# EAGLE design stencil (EAGLE 9.6.2)

## Sheet 1 of 2
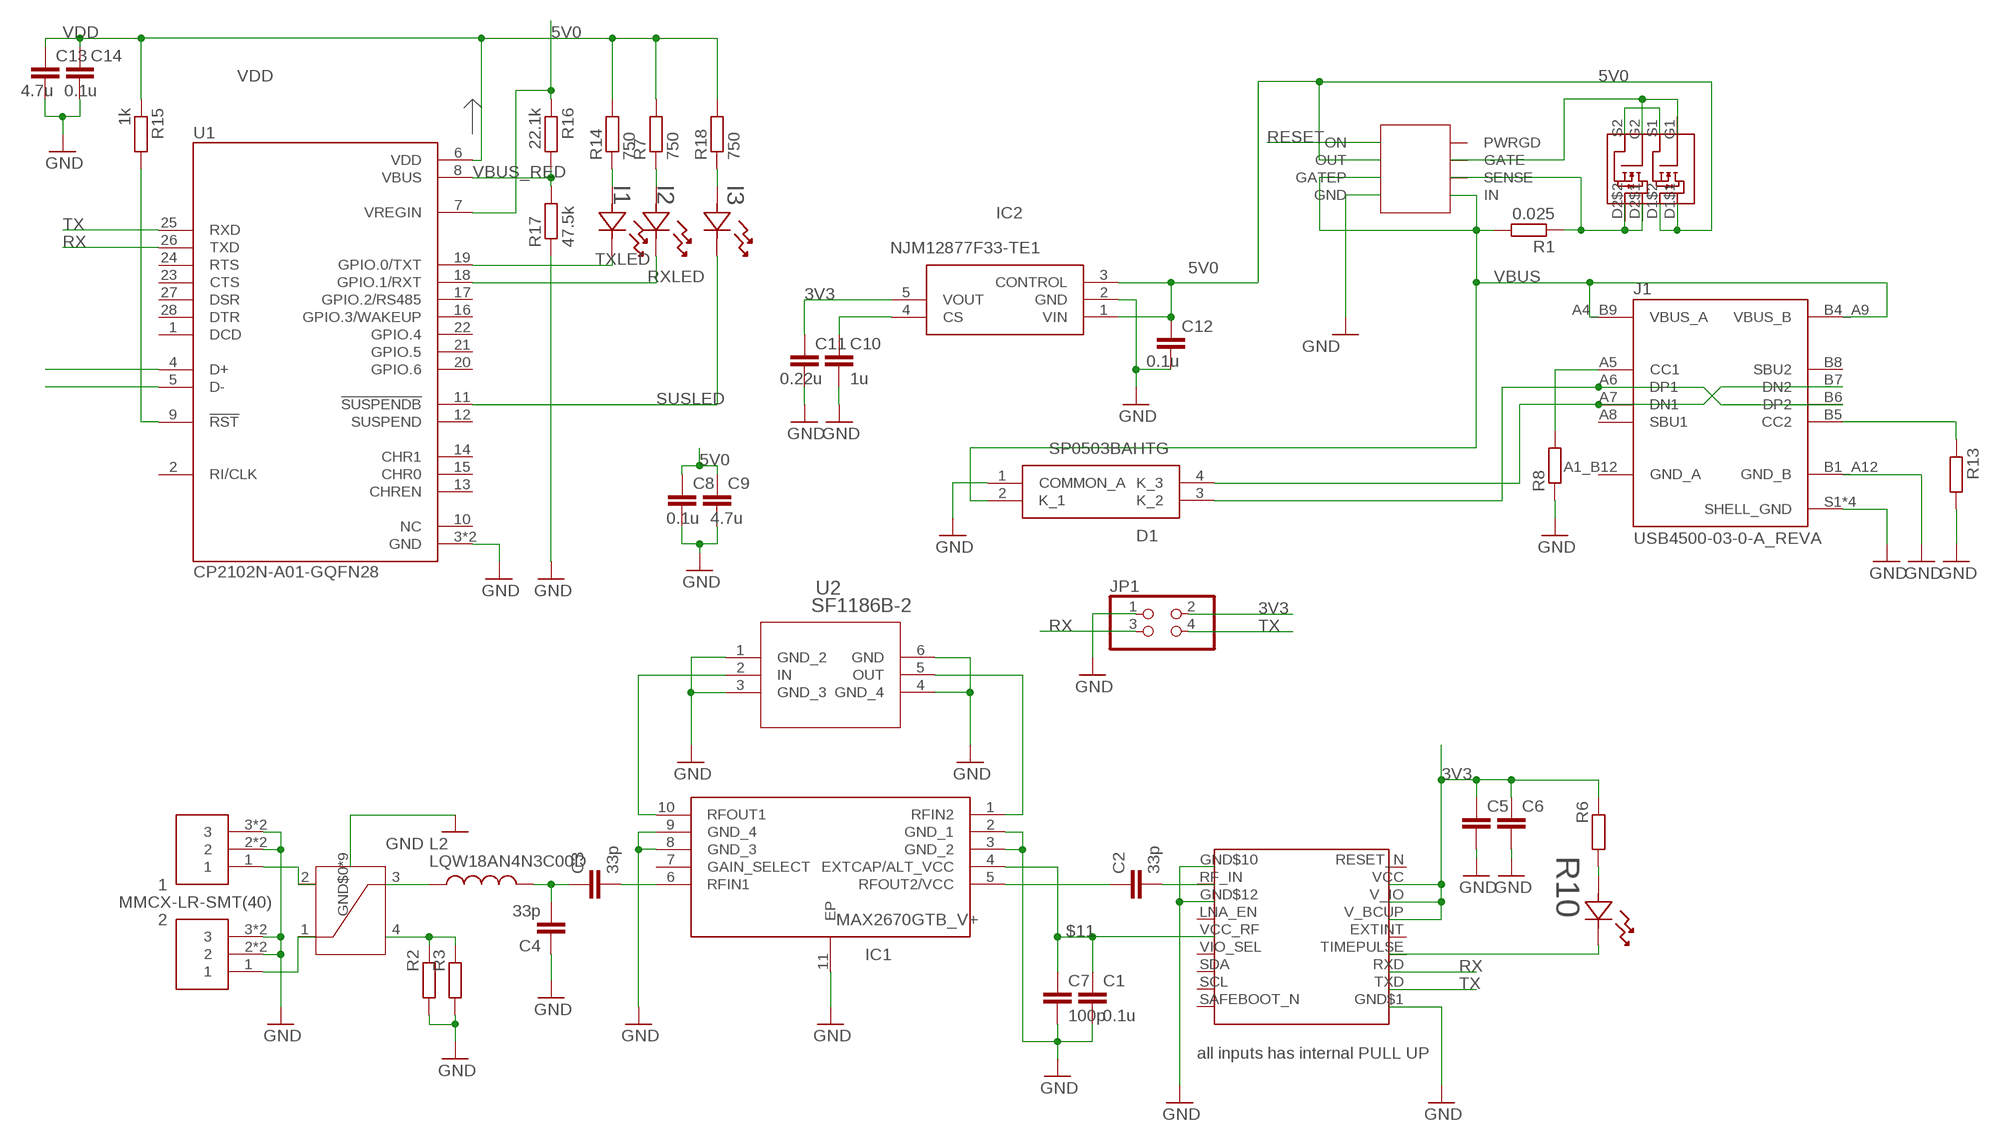
[diagram p0: schematic, sheet 1]

### Parts
1  MMCX-LR-SMT(40)  [MMCX-LR-SMT(40)]
2  MMCX-LR-SMT(40)  [MMCX-LR-SMT(40)]
C1  0.1u  C-EUC1608  [C1608]
C2  33p  C-EUC1608  [C1608]
C3  33p  C-EUC1608  [C1608]
C4  33p  C-EUC1608  [C1608]
C5  C-EUC1608  [C1608]
C6  C-EUC1608  [C1608]
C7  100p  C-EUC1608  [C1608]
C8  0.1u  C-EUC1608  [C1608]
C9  4.7u  C-EUC1608  [C1608]
C10  1u  C-EUC1608  [C1608]
C11  0.22u  C-EUC1608  [C1608]
C12  0.1u  C-EUC1608  [C1608]
C13  4.7u  C-EUC1608  [C1608]
C14  0.1u  C-EUC1608  [C1608]
D1  SP0503BAHTG  [SP0503BAHTG]
I1  SML-E12P8WT86  [LED_SMLD12_ROM]
I2  SML-E12P8WT86  [LED_SMLD12_ROM]
I3  SML-E12P8WT86  [LED_SMLD12_ROM]
IC1  MAX2670GTB_V+  [SON50P300X300X80-11N]
IC2  NJM12877F33-TE1  [SOT95P280X120-5N]
J1  USB4500-03-0-A_REVA  [GCT_USB4500-03-0-A_REVA]
JP1  PINHD-2X2  [2X02]
L2  LQW18AN4N3C00D  [INDC1608X100N]
R1  0.025  R-EU_R0603  [R0603]
R2  R-EU_R0603  [R0603]
R3  R-EU_R0603  [R0603]
R6  R-EU_R0603  [R0603]
R7  750  R-EU_R0603  [R0603]
R8  R-EU_R0603  [R0603]
R10  SML-E12P8WT86  [LED_SMLD12_ROM]
R13  R-EU_R0603  [R0603]
R14  750  R-EU_R0603  [R0603]
R15  1k  R-EU_R0603  [R0603]
R16  22.1k  R-EU_R0603  [R0603]
R17  47.5k  R-EU_R0603  [R0603]
R18  750  R-EU_R0603  [R0603]
U1  CP2102N-A01-GQFN28  [QFN50P500X500X80-29N]
U2  SF1186B-2  [SM3030_MUR]
U$1  MAX_M10S  [MAX-M10S]
U$3  HC125.A  [HC125.A]
U$7  DMG6898LSD  [SOIC127P600X150-8N]
U$8  LTC4361  [SOP65P280X100-8N]

### Nets
3V3 [POWER]: C5.1 C6.1 C11.1 IC2.5(VOUT) JP1.2 R6.2 U$1.V_BCUP(V_BCKP) U$1.V_IO U$1.VCC ; also sheet 2
5V0 [POWER]: C8.1 C9.1 C12.1 IC2.1(VIN) IC2.3(CONTROL) R16.1 U1.7(VREGIN) U$7.D1$1 U$7.D1$2 U$8.OUT ; also sheet 2
$11 [POWER]: C1.1 C7.1 IC1.4(EXTCAP/ALT_VCC) U$1.VCC_RF
D+: D1.3(K_2) J1.A6(DP1) J1.B6(DP2) U1.4(D+)
D-: D1.4(K_3) J1.A7(DN1) J1.B7(DN2) U1.5(D-)
GND [50Ohm]: 1.2 1.3 1.4 1.5 2.2 2.3 2.4 2.5 C1.2 C4.1 C5.2 C6.2 C7.2 C8.2 C9.2 C10.2 C11.2 C12.2 C13.2 C14.2 D1.1(COMMON_A) IC1.2(GND_1) IC1.3(GND_2) IC1.8(GND_3) IC1.9(GND_4) IC1.11(EP) IC2.2(GND) J1.B1_A12(GND_B) J1.S1(SHELL_GND) J1.S2(SHELL_GND) J1.S3(SHELL_GND) J1.S4(SHELL_GND) JP1.1 R2.1 R3.1 R8.1 R13.2 R17.1 U1.3(GND) U1.29(GND) U2.1(GND_2) U2.3(GND_3) U2.4(GND_4) U2.6(GND) U$1.GND$1 U$1.GND$10 U$1.GND$12 U$3.GND$0(GND) U$3.GND$1(GND) U$3.GND$2(GND) U$3.GND$3(GND) U$3.GND$4(GND) U$3.GND$5(GND) U$3.GND$6(GND) U$3.GND$7(GND) U$3.GND$8(GND) U$8.GND ; also sheet 2
N$1 [1.1mm]: 1.1 U$3.2
N$2 [1.1mm]: 2.1 U$3.1
N$4: C10.1 IC2.4(CS)
N$5: I2.2 R7.1
N$6 [gnd]: R2.2 R3.2 U$3.4
N$7 [gnd]: L2.1 U$3.3
N$8 [gnd]: IC1.10(RFOUT1) U2.2(IN)
N$9 [gnd]: IC1.1(RFIN2) U2.5(OUT)
N$10 [gnd]: C3.2 IC1.6(RFIN1)
N$11 [gnd]: C2.1 IC1.5(RFOUT2/VCC)
N$12 [gnd]: C2.2 U$1.RF_IN
N$13: I1.2 R14.1
N$14: R10.1 U$1.TIMEPULSE
N$15: R6.1 R10.2
N$16: I3.2 R18.1
N$17 [gnd]: C3.1 C4.2 L2.2
N$19: U$7.S1 U$7.S2
N$20: R1.1 U$7.D2$1 U$7.D2$2 U$8.SENSE
N$21: J1.B5(CC2) R13.1
N$22: U$7.G1 U$7.G2 U$8.GATE
N$23: J1.A5(CC1) R8.2
N$27: R15.2 U1.9(!RST)
RESET [50Ohm]: U$8.ON
RX: JP1.3 U1.26(TXD) U$1.RXD ; also sheet 2
RXLED: I2.1 U1.18(GPIO.1/RXT)
SUSLED: I3.1 U1.11(!SUSPENDB)
TX: JP1.4 U1.25(RXD) U$1.TXD ; also sheet 2
TXLED: I1.1 U1.19(GPIO.0/TXT)
VBUS: D1.2(K_1) J1.A4_B9(VBUS_A) J1.B4_A9(VBUS_B) R1.2 U$8.GATEP U$8.IN
VBUS_RED: R16.2 R17.2 U1.8(VBUS)
VDD: C13.1 C14.1 R7.2 R14.2 R15.1 R18.2 U1.6(VDD)
Unconnected: IC1.7(GAIN_SELECT) J1.A8(SBU1) J1.B8(SBU2) U1.1(DCD) U1.2(RI/CLK) U1.10(NC) U1.12(SUSPEND) U1.13(CHREN) U1.14(CHR1) U1.15(CHR0) U1.16(GPIO.3/WAKEUP) U1.17(GPIO.2/RS485) U1.20(GPIO.6) U1.21(GPIO.5) U1.22(GPIO.4) U1.23(CTS) U1.24(RTS) U1.27(DSR) U1.28(DTR) U$1.EXTINT U$1.LNA_EN U$1.RESET_N U$1.SAFEBOOT_N U$1.SCL U$1.SDA U$1.VIO_SEL U$8.PWRGD

### Notes on the sheet
- all inputs has internal PULL UP

## Sheet 2 of 2
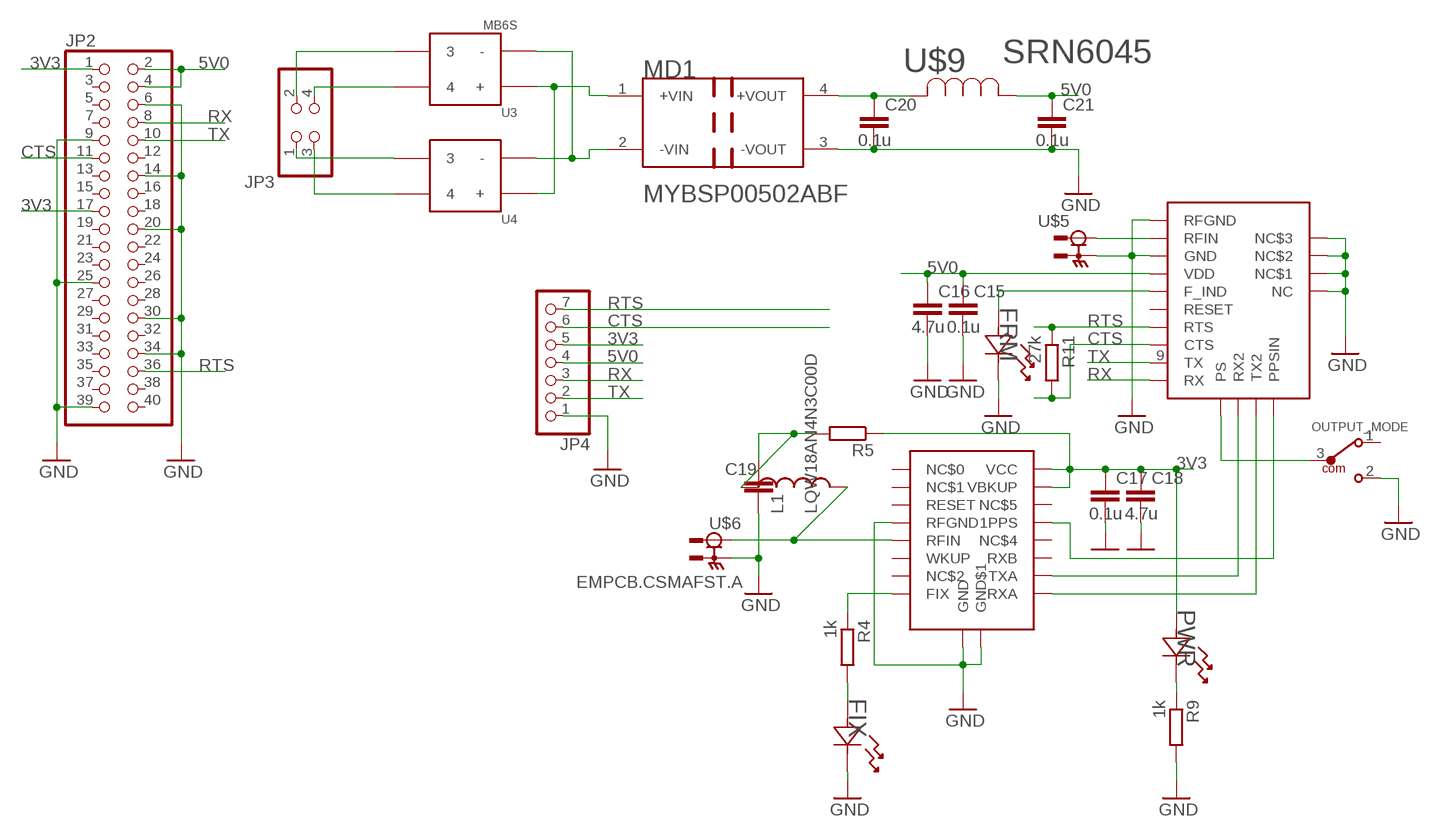
[diagram p1: schematic, sheet 2]

### Parts
C15  0.1u  C-EUC1608  [C1608]
C16  4.7u  C-EUC1608  [C1608]
C17  0.1u  C-EUC1608  [C1608]
C18  4.7u  C-EUC1608  [C1608]
C19  C-EUC1608  [C1608]
C20  0.1u  C-EUC1608  [C1608]
C21  0.1u  C-EUC1608  [C1608]
FIX  SML-E12P8WT86  [LED_SMLD12_ROM]
FRM  SML-E12P8WT86  [LED_SMLD12_ROM]
JP2  PINHD-2X20  [2X20]
JP3  PINHD-2X2  [2X02]
JP4  PINHD-1X7/90  [1X07/90]
L1  LQW18AN4N3C00D  [INDC1608X100N]
MD1  MURATA_MYBSP00502ABFMURATA_MYBSP00502ABF_0_0  [MURATA_MYBSP00502ABF_0]
OUTPUT_MODE  450405020524  [450405020524]
PWR  SML-E12P8WT86  [LED_SMLD12_ROM]
R4  1k  R-EU_R0603  [R0603]
R5  R-EU_R0603  [R0603]
R9  1k  R-EU_R0603  [R0603]
R11  27k  R-EU_R0603_NOSILK  [R0603_NOSILK]
U3  MB6S  [SOIC245P670X270-4N]
U4  MB6S  [SOIC245P670X270-4N]
U$2  GNS5894T  [GNS5XXX]
U$4  GNS3303  [GNS3303]
U$5  EMPCB.CSMAFST.A  [EMPCB.CSMAFST.A]
U$6  EMPCB.CSMAFST.A  [EMPCB.CSMAFST.A]
U$9  SRN6045  [IND_BOURNS_SRN6045]

### Nets
3V3 [POWER]: C17.1 C18.1 JP2.1 JP2.17 JP4.5 PWR.2 R5.1 U$4.15(VBKUP) U$4.16(VCC) ; also sheet 1
5V0 [POWER]: C15.1 C16.1 C21.1 JP2.2 JP2.4 JP4.4 U$2.4(VDD) U$9.1 ; also sheet 1
CTS: JP2.11 JP4.6 R11.2 U$2.8(CTS)
GND [50Ohm]: C15.2 C16.2 C17.2 C18.2 C19.2 C20.2 C21.2 FIX.1 FRM.1 JP2.6 JP2.9 JP2.14 JP2.20 JP2.25 JP2.30 JP2.34 JP2.39 JP4.1 MD1.3(-VOUT) OUTPUT_MODE.2 R9.2 U$2.1(RFGND) U$2.3(GND) U$2.15(NC) U$2.16(NC$1) U$2.17(NC$2) U$2.18(NC$3) U$4.4(RFGND) U$4.E1(GND) U$4.E2(GND$1) U$5.GND$0 U$5.GND$1 U$5.GND$2 U$5.GND$3 U$6.GND$0 U$6.GND$1 U$6.GND$2 U$6.GND$3 ; also sheet 1
N$3: FRM.2 U$2.5(F_IND)
N$18: U$2.12(RX2) U$4.10(TXA)
N$24: U$2.13(TX2) U$4.9(RXA)
N$25: U$2.14(PPSIN) U$4.13(1PPS)
N$26: R4.1 U$4.8(FIX)
N$28: FIX.2 R4.2
N$29 [50Ohm]: C19.1 L1.1 R5.2
N$30: OUTPUT_MODE.3 U$2.11(PS)
N$31: PWR.1 R9.1
N$32: JP3.4 U3.4
N$33: JP3.2 U3.3
N$34: JP3.3 U4.4
N$35: JP3.1 U4.3
N$36: MD1.2(-VIN) U3.2(-) U4.2(-)
N$37: MD1.1(+VIN) U3.1(+) U4.1(+)
N$38: C20.1 MD1.4(+VOUT) U$9.2
RF1 [50Ohm]: L1.2 U$4.5(RFIN) U$6.RF
RF2 [50Ohm]: U$2.2(RFIN) U$5.RF
RTS: JP2.36 JP4.7 R11.1 U$2.7(RTS)
RX: JP2.8 JP4.3 U$2.10(RX) ; also sheet 1
TX: JP2.10 JP4.2 U$2.9(TX) ; also sheet 1
Unconnected: JP2.3 JP2.5 JP2.7 JP2.12 JP2.13 JP2.15 JP2.16 JP2.18 JP2.19 JP2.21 JP2.22 JP2.23 JP2.24 JP2.26 JP2.27 JP2.28 JP2.29 JP2.31 JP2.32 JP2.33 JP2.35 JP2.37 JP2.38 JP2.40 OUTPUT_MODE.1 U$2.6(RESET) U$4.1(NC$0) U$4.2(NC$1) U$4.3(RESET) U$4.6(WKUP) U$4.7(NC$2) U$4.11(RXB) U$4.12(NC$4) U$4.14(NC$5)

## Power pins joined to a net without a drawn wire
GND: J1.A1_B12(GND_A)

## Library data of the parts
1 2 = MMCX-LR-SMT(40):MMCX-LR-SMT(40)
C1-C21 = rcl:C-EU: CAPACITOR, European symbol; SPICEPREFIX: C
D1 = SamacSys_Parts:SP0503BAHTG: ESD Suppressors / TVS Diodes TVS AVAL DIODE SMT Source: Datasheet <https://nl.mouser.com/datasheet/2/240/Littelfuse_TVS_Diode_Array_SP05_Datasheet.pdf-777043.pdf>; ARROW_PART_NUMBER: SP0503BAHTG; ARROW_PRICE-STOCK: https://www.arrow.com/en/products/sp0503bahtg/littelfuse?region=europe; DESCRIPTION: ESD Suppressors / TVS Diodes TVS AVAL DIODE SMT; HEIGHT: 1.22mm; MANUFACTURER_NAME: LITTELFUSE; MANUFACTURER_PART_NUMBER: SP0503BAHTG; MOUSER_PART_NUMBER: 576-SP0503BAHTG; MOUSER_PRICE-STOCK: https://www.mouser.co.uk/ProductDetail/Littelfuse/SP0503BAHTG?qs=uD%2FdkN7XIa0NTYXwHdELYA%3D%3D
FIX FRM I1-I3 PWR R10 = LED_1608_2:SML-E12P8WT86; COPYRIGHT: Copyright (C) 2023 Ultra Librarian. All rights reserved.; DIGI-KEY_PART_NUMBER_1: 511-1585-1-ND; DIGI-KEY_PART_NUMBER_2: 511-1585-2-ND; DIGI-KEY_PART_NUMBER_3: 511-1585-6-ND; MANUFACTURER_PART_NUMBER: SML-E12P8WT86; MFR_NAME: ROHM Semiconductor
IC1 = MAX2670GTB_V+:MAX2670GTB_V+: RF Amplifier GPS/GNSS Front End Amplifier Source: Datasheet <https://componentsearchengine.com/Datasheets/1/MAX2670GTB_V .pdf>; DESCRIPTION: RF Amplifier GPS/GNSS Front End Amplifier; HEIGHT: 0.8mm; MANUFACTURER_NAME: Analog Devices; MANUFACTURER_PART_NUMBER: MAX2670GTB/V+; MOUSER_PART_NUMBER: 700-MAX2670GTB/V+; MOUSER_PRICE-STOCK: https://www.mouser.com/Search/Refine.aspx?Keyword=700-MAX2670GTB%2FV%2B
IC2 = SamacSys_Parts:NJM12877F33-TE1: LDO Voltage Regulators LDO ADJ High Ripple 3.3V Vo 1% 200mA Source: Datasheet <https://datasheet.datasheetarchive.com/originals/distributors/Datasheets_SAMA/e828f6bebe4b9138c37698b69374413c.pdf>; DESCRIPTION: LDO Voltage Regulators LDO ADJ High Ripple 3.3V Vo 1% 200mA; HEIGHT: 1.2mm; MANUFACTURER_NAME: New Japan Radio; MANUFACTURER_PART_NUMBER: NJM12877F33-TE1; MOUSER_PART_NUMBER: 513-NJM12877F33-TE1; MOUSER_PRICE-STOCK: https://www.mouser.com/Search/Refine.aspx?Keyword=513-NJM12877F33-TE1
J1 = USB4500-03-0-A_REVA:USB4500-03-0-A_REVA; DESCRIPTION: USB-C (USB TYPE-C) USB 2.0 Receptacle Connector 24 (16+8 Dummy) Position Board Edge, Cutout; Surface Mount; Through Hole, Right Angle; DIGI-KEY_PART_NUMBER: 2073-USB4500-03-0-ATR-ND; MF: Global Connector Technology; MP: USB4500-03-0-A; PACKAGE: None; PURCHASE-URL: https://pricing.snapeda.com/search/part/USB4500-03-0-A/?ref=eda
JP1 JP3 = pinhead:PINHD-2X2: PIN HEADER
JP2 = pinhead:PINHD-2X20: PIN HEADER
JP4 = pinhead:PINHD-1X7: PIN HEADER
L1 L2 = LQW18AN4N3C00D:LQW18AN4N3C00D: 2.3 NH +/-.1NH; DESCRIPTION: Inductor with Inductance: 4.3nH Tol. +/-0.2nH, Package: 0603 (1608); DIGIKEY_PART_NUMBER: 490-6896-2-ND; MF: Murata; MP: LQW18AN4N3C00D; PACKAGE: 1608 Murata; PURCHASE-URL: https://pricing.snapeda.com/search?q=LQW18AN4N3C00D&ref=eda
MD1 = MURATA_MYBSP00502ABF:MURATA_MYBSP00502ABF: Isolated PoE Module DC DC Converter Output 5V - - - 2A 37V - 57V Input Check availability <https://pricing.snapeda.com/parts/MYBSP00502ABF/Murata%20Power%20Solutions%20Inc./view-part?ref=eda>; AVAILABILITY: In Stock; DESCRIPTION: Isolated PoE Module DC DC Converter 1 Output 5V - - - 2A 37V - 57V Input; MF: Murata Power Solutions Inc.; MP: MYBSP00502ABF; PACKAGE: None; PRICE: None; PURCHASE-URL: https://pricing.snapeda.com/search?q=MYBSP00502ABF&ref=eda
OUTPUT_MODE = WS-SLSU (rev20b):450405020524: WS-SLSU SMT Mini Slide Switch Same Side Connection 8.7x3.0 mm PROPERTIES Actuator Material PA46 Actuator Flammability Rating UL94 HB Actuator Color Black Frame Material LCP Frame Flammability Rating UL94 V-0 Frame Color Black Contact Material Copper Alloy Contact Plating Silver Terminal Material Copper Alloy Terminal Plating Silver VR 5 V (DC) Contact Resistance Initial 70 mΩ Contact Resistance After Life Test 500 mΩ RISO 100 MΩ Withstanding Voltage 250 V (AC) ELECTRICAL PROPERTIES IR 300 mA MECHANICAL PROPERTIES Operation Force 225 g PACKAGING PROPERTIES Packaging Tape and Reel <https://katalog.we-online.com/media/images/v2/o158949v209%20WS-SLSU-450405020524.jpg> Details see: https://www.we-online.com/catalog/en/WS_SLSU_SMT_MINI_SLIDE_SWITCH_SAME_SIDE_8_7_x_3_0/ Updated by Ella Wu 2020-03-24 2020(C) Wurth Elektronik; DATASHEET-URL: https://www.we-online.com/catalog/datasheet/450405020524.pdf; IR: 300mA; PACKAGING: Tape and Reel; PART-NUMBER: 450405020524; VR: 5V(DC)
R1-R9 R13-R18 = rcl:R-EU_: RESISTOR, European symbol; SPICEPREFIX: R
R11 = rcl:R-EU_: RESISTOR, European symbol
U1 = CP2102N-A01-GQFN28:CP2102N-A01-GQFN28: USB Bridge, USB to UART USB 2.0 UART Interface 28-QFN (5x5) Check availability <https://pricing.snapeda.com/parts/CP2102N-A01-GQFN28/Silicon%20Labs/view-part?ref=eda>; AVAILABILITY: In Stock; DESCRIPTION: USB Bridge, USB to UART USB 2.0 UART Interface 28-QFN (5x5); MF: Silicon Labs; MP: CP2102N-A01-GQFN28; PACKAGE: QFN-28 Silicon Labs; PRICE: None; PURCHASE-URL: https://pricing.snapeda.com/search/part/CP2102N-A01-GQFN28/?ref=eda
U2 = SF1186B-2:SF1186B-2; COPYRIGHT: Copyright (C) 2023 Ultra Librarian. All rights reserved.; MANUFACTURER_PART_NUMBER: SF1186B-2; MFR_NAME: Murata
U3 U4 = MB6S:MB6S: MB6S Series 600 V 0.5 A 5 uA Surface Mount Bridge Rectifier - SOIC-4 Check availability <https://pricing.snapeda.com/parts/MB6S/onsemi/view-part?ref=eda>; AVAILABILITY: In Stock; DESCRIPTION: Bridge Rectifier Single Phase Standard 600 V Surface Mount 4-SOIC; MF: onsemi; MP: MB6S; PACKAGE: None; PRICE: None; PURCHASE-URL: https://pricing.snapeda.com/search?q=MB6S&ref=eda
U$1 = MAX-M10S:MAX_M10S
U$2 = GNS5894T:GNS5894T
U$3 = HC125.A:HC125.A
U$4 = GNS3303:GNS3303
U$5 U$6 = EMPCB.CSMAFSTJ.A:EMPCB.CSMAFST.A
U$7 = DMG6898LSD:DMG6898LSD
U$8 = ltc4361:LTC4361
U$9 = SRN6045:SRN6045

## Net classes
0 default: clearance 0.121 mm
1 gnd: width 0.254 mm, clearance 0.254 mm
2 50Ohm: clearance 0.4 mm to class 1
3 POWER: width 0.127 mm, clearance 0.025 mm
4 1.1mm: clearance 0.247 mm to class 1

## Board
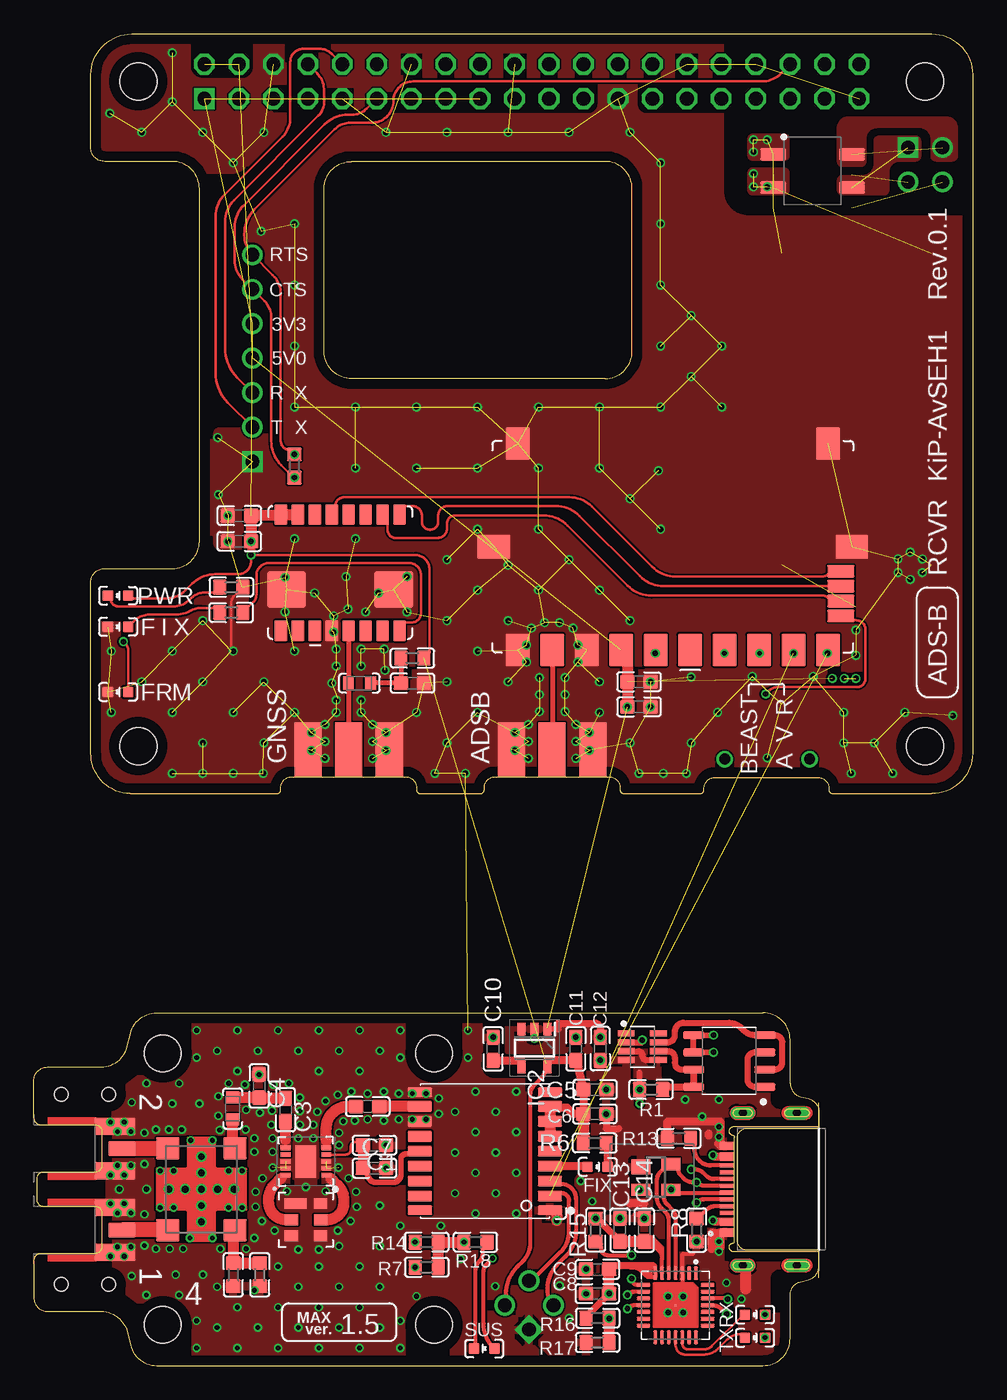
[diagram p2: board, top side]
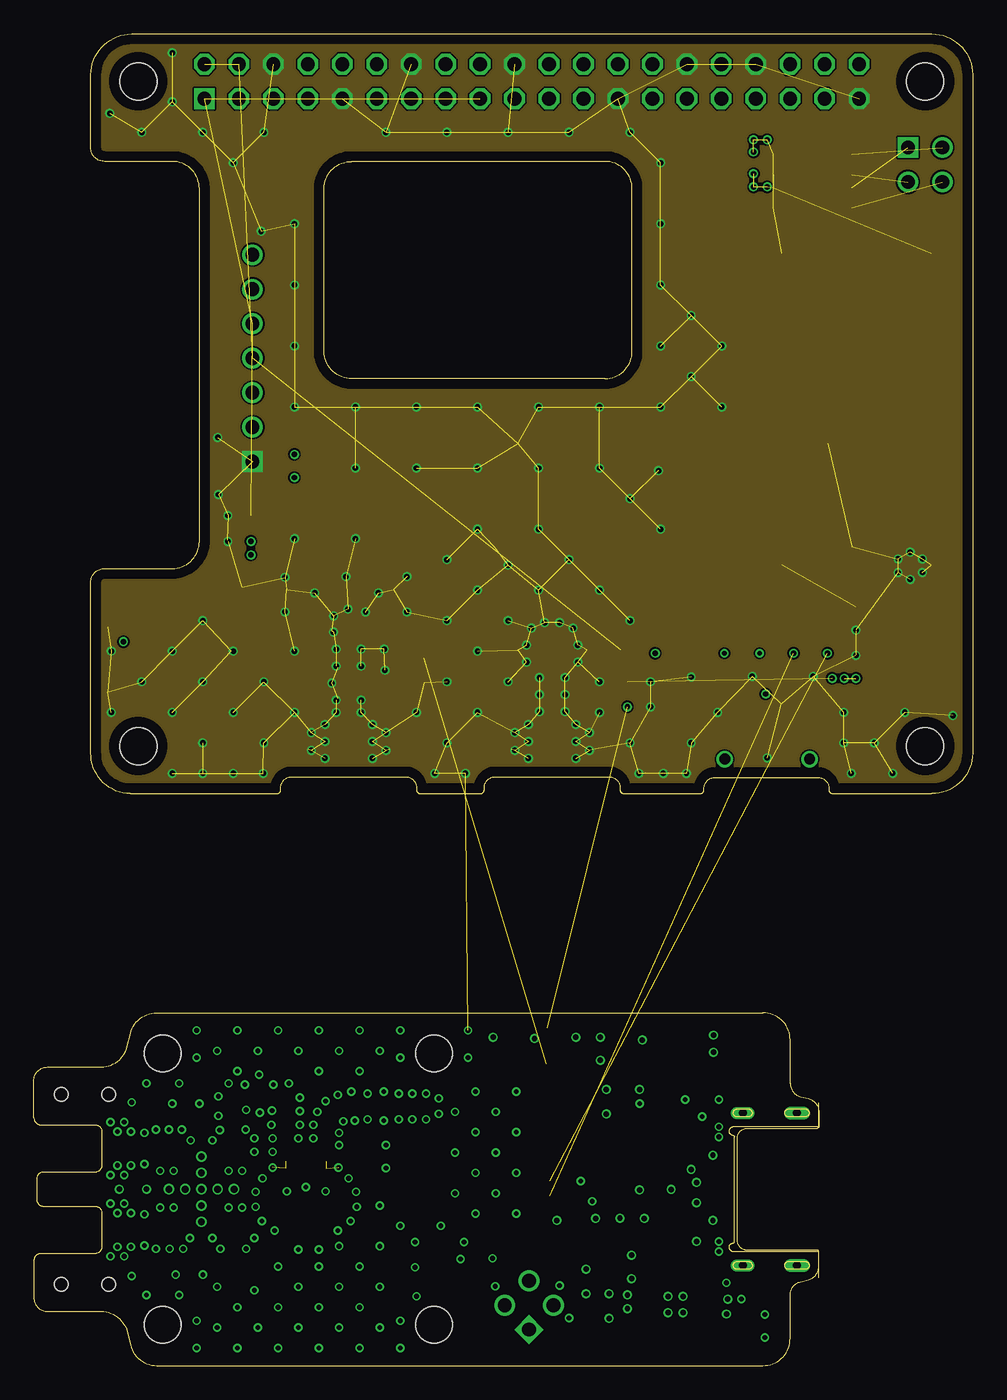
[diagram p3: board, inner layer Route2]
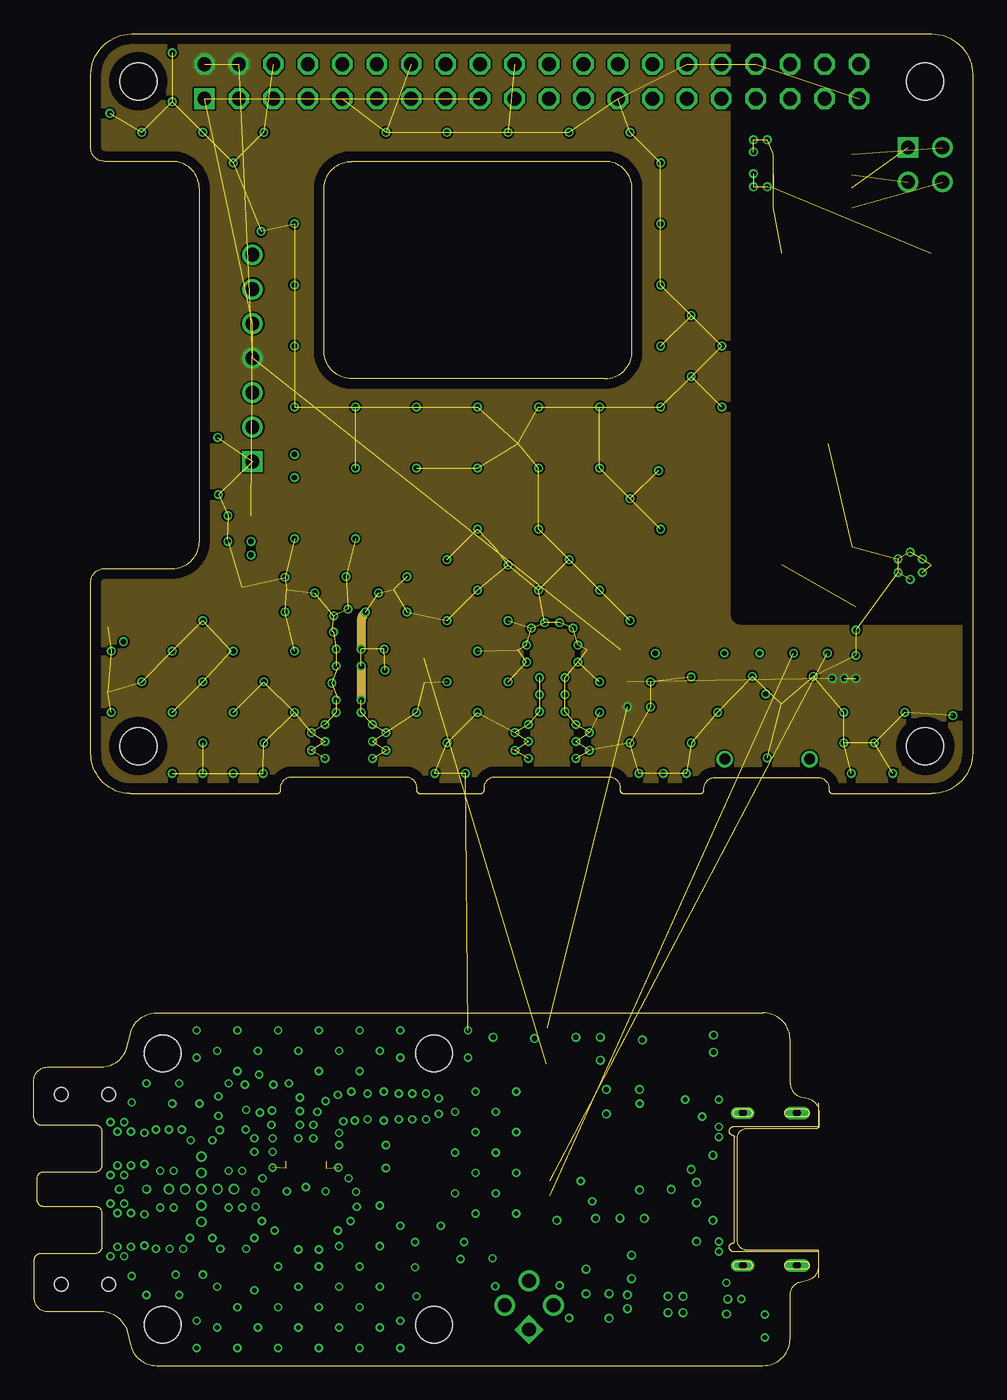
[diagram p4: board, inner layer Route15]
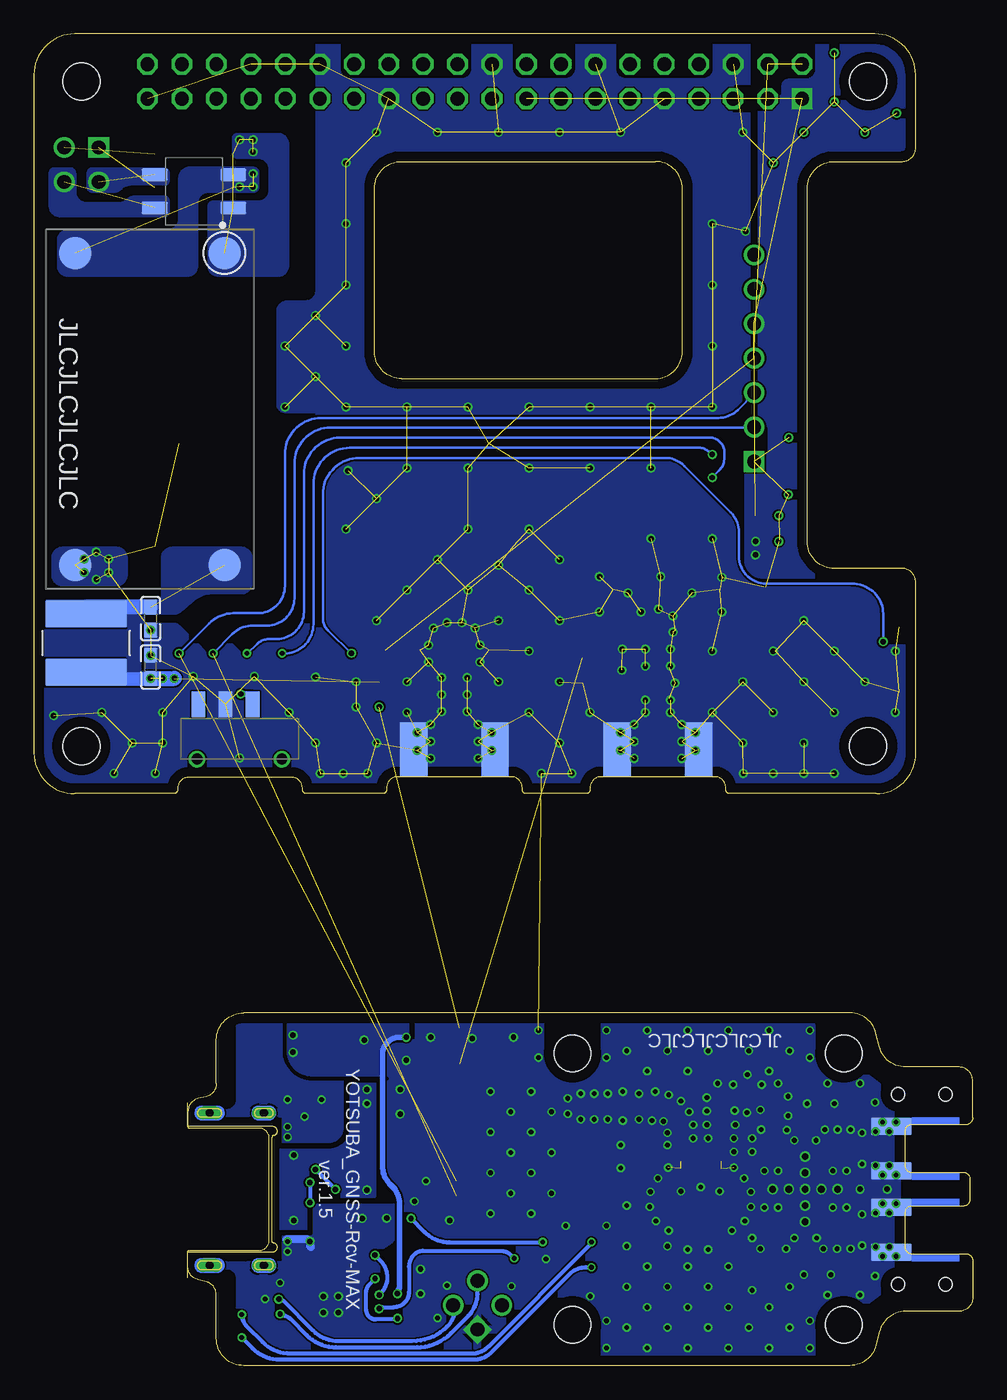
[diagram p5: board, bottom side, seen from below]

Size 69.2 x 98.15 mm. Coordinates in mm from the lower left corner, seen from the top.
Outline: 1,4 4.94,4 arc-76 6.88,2.48 7.12,1.51 arc76 9.06,0 53.75,0 arc90 55.75,2 55.75,5.21 arc-77 56.52,6.18 57.08,6.32 arc77 57.85,7.29 57.85,8.4 arc90 57.75,8.5 52.6,8.5 arc-90 51.85,9.25 51.85,16.75 arc-90 52.6,17.5 57.75,17.5 arc90 57.85,17.6 57.85,18.71 arc77 57.08,19.68 56.52,19.82 arc-77 55.75,20.79 55.75,24 arc90 53.75,26 9.06,26 arc76 7.12,24.48 6.88,23.52 arc-76 4.94,22 1,22 arc90 0,21 0,18.25 arc90 0.5,17.75 4.5,17.75 arc-90 5,17.25 5,14.75 arc-90 4.5,14.25 0.7,14.25 arc90 0.2,13.75 0.2,12.25 arc90 0.7,11.75 4.5,11.75 arc-90 5,11.25 5,8.75 arc-90 4.5,8.25 0.5,8.25 arc90 0,7.75 0,5 arc90 1,4
Outline: 28.2,42.6 28.2,42.45 arc90 28.5,42.15 32.9,42.15 arc90 33.2,42.45 33.2,42.6 arc-90 34,43.4 42.4,43.4 arc-90 43.2,42.6 43.2,42.45 arc90 43.5,42.15 49.1,42.15 arc90 49.4,42.45 49.4,42.55 arc-90 50.2,43.35 57.8,43.35 arc-90 58.6,42.55 58.6,42.45 arc90 58.9,42.15 66.2,42.15 arc90 69.2,45.15 69.2,95.15 arc90 66.2,98.15 7.2,98.15 arc90 4.2,95.15 4.2,89.75 arc90 5.2,88.75 10.2,88.75 arc-90 12.2,86.75 12.2,60.75 arc-90 10.2,58.75 5.2,58.75 arc90 4.2,57.75 4.2,45.15 arc90 7.1,42.15 17.9,42.15 arc90 18.2,42.45 18.2,42.6 arc-90 19,43.4 27.4,43.4 arc-90 28.2,42.6
Outline: 42.1,72.75 23.4,72.75 arc-90 21.4,74.75 21.4,86.75 arc-90 23.4,88.75 42.1,88.75 arc-90 44.1,86.75 44.1,74.75 arc-90 42.1,72.75
Copper layers (1*16): Top 0.035mm / dielectric 0.2104mm / Bottom 0.035mm
Design rules "JLCPCB_2L *": minimum track width 5mil, minimum drill 0.15mm, track to track 5mil, track to pad 5mil, pad to pad 5mil, via to via 5mil, smd to smd 5mil, copper to edge 30mil, drill to drill 0.5mm, minimum pad ring 0.13mm, minimum via ring 0.13mm, stop-mask expansion 0.038mm, vias tented up to drill 0.4mm, thermal gap 10mil
Holes 1 mm at 2,6 5.5,6 2,20 5.5,20
Holes 2.7 mm at 9.5,3 9.5,23 29.5,23 29.5,3
Holes 2.75 mm at 7.7,45.65 7.7,94.65 65.7,94.65 65.7,45.65
tRestrict: area 47.3,95.1 to 49,96.7; area 34.6,95.2 to 36.3,96.7; area 27.1,95.2 to 28.6,96.7; area 21.9,92.6 to 23.6,94.2; 103 lines
bRestrict: 69 lines

### Footprints (pad centres in the part's own frame; a part is rotated, then mirrored left to right if it is on the bottom)
MMCX-LR-SMT(40) = smd 1.1 x 2: 1 0,-2 | smd 1.3 x 3: 2 1.65,-1.5; 3 -1.65,-1.5 | smd 1.3 x 3 bottom: 4 -1.65,-1.5; 5 1.65,-1.5
C1608 = smd 1.1 x 1: 1 -0.85,0; 2 0.85,0
SP0503BAHTG = smd 1.1 x 1.4: 1 -0.75,-1.1 | smd 0.9 x 1.4: 2 0.95,-1.1; 3 0.95,1.1; 4 -0.95,1.1
LED_SMLD12_ROM = smd 0.8 x 0.8: 1 -0.75,0; 2 0.75,0
SON50P300X300X80-11N = smd 0.75 x 0.3: 1 -1.5,1; 2 -1.5,0.5; 3 -1.5,0; 4 -1.5,-0.5; 5 -1.5,-1; 6 1.5,-1; 7 1.5,-0.5; 8 1.5,0; 9 1.5,0.5; 10 1.5,1 | smd 1.6 x 2.4: 11 0,0
SOT95P280X120-5N = smd 0.9 x 0.6: 1 -1.4,0.95; 2 -1.4,0; 3 -1.4,-0.95; 4 1.4,-0.95; 5 1.4,0.95
GCT_USB4500-03-0-A_REVA = smd 0.6 x 1.1: A1_B12 -3.2,5.15; A4_B9 -2.4,5.15; B1_A12 3.2,5.15; B4_A9 2.4,5.15 | smd 0.3 x 1.1: A5 -1.25,5.15; A6 -0.25,5.15; A7 0.25,5.15; A8 1.25,5.15; B5 1.75,5.15; B6 0.75,5.15; B7 -0.75,5.15; B8 -1.75,5.15 | drill 0.6 pad 0.95 long: S1 -5.62,0; S4 5.62,0 | drill 0.6 pad 0.8 long: S2 5.62,4; S3 -5.62,4
2X02 = drill 1.016 square: 1 -1.27,-1.27 | drill 1.016: 2 -1.27,1.27; 3 1.27,-1.27; 4 1.27,1.27
2X20 = drill 1.016 square: 1 -24.13,-1.27 | drill 1.016 octagon: 2 -24.13,1.27; 3 -21.59,-1.27; 4 -21.59,1.27; 5 -19.05,-1.27; 6 -19.05,1.27; 7 -16.51,-1.27; 8 -16.51,1.27; 9 -13.97,-1.27; 10 -13.97,1.27; 11 -11.43,-1.27; 12 -11.43,1.27; 13 -8.89,-1.27; 14 -8.89,1.27; 15 -6.35,-1.27; 16 -6.35,1.27; 17 -3.81,-1.27; 18 -3.81,1.27; 19 -1.27,-1.27; 20 -1.27,1.27; 21 1.27,-1.27; 22 1.27,1.27; 23 3.81,-1.27; 24 3.81,1.27; 25 6.35,-1.27; 26 6.35,1.27; 27 8.89,-1.27; 28 8.89,1.27; 29 11.43,-1.27; 30 11.43,1.27; 31 13.97,-1.27; 32 13.97,1.27; 33 16.51,-1.27; 34 16.51,1.27; 35 19.05,-1.27; 36 19.05,1.27; 37 21.59,-1.27; 38 21.59,1.27; 39 24.13,-1.27; 40 24.13,1.27
1X07/90 = drill 1.016 square: 1 -7.62,-3.81 | drill 1.016: 2 -5.08,-3.81; 3 -2.54,-3.81; 4 0,-3.81; 5 2.54,-3.81; 6 5.08,-3.81; 7 7.62,-3.81
INDC1608X100N = smd 0.89 x 1.02: 1 -0.814,0; 2 0.814,0
MURATA_MYBSP00502ABF_0 = smd 2.4 x 2.4: 1 -3.7,-13.15; 2 7.3,-13.15; 3 7.3,9.85; 4 -3.7,9.85
450405020524 = smd 1 x 1.9: 1 -3.03,4.05; 2 -1.03,4.05; 3 0.97,4.05 | drill 0.8: MH1 -3.125,0; MH2 3.125,0
R0603 = smd 1 x 1.1: 1 -0.85,0; 2 0.85,0
R0603_NOSILK = smd 1 x 1.1: 1 -0.85,0; 2 0.85,0
QFN50P500X500X80-29N = smd 1.01 x 0.3: 1 -2.36,1.5; 2 -2.36,1; 3 -2.36,0.5; 4 -2.36,0; 5 -2.36,-0.5; 6 -2.36,-1; 7 -2.36,-1.5; 15 2.36,-1.5; 16 2.36,-1; 17 2.36,-0.5; 18 2.36,0; 19 2.36,0.5; 20 2.36,1; 21 2.36,1.5 | smd 0.3 x 1.01: 8 -1.5,-2.36; 9 -1,-2.36; 10 -0.5,-2.36; 11 0,-2.36; 12 0.5,-2.36; 13 1,-2.36; 14 1.5,-2.36; 22 1.5,2.36; 23 1,2.36; 24 0.5,2.36; 25 0,2.36; 26 -0.5,2.36; 27 -1,2.36; 28 -1.5,2.36 | smd 0.127 x 0.127: 29 0,0
SM3030_MUR = smd 1.7 x 0.81: 1 -0.75,1.19 | smd 1.05 x 0.81: 2 -1.075,0; 3 -1.075,-1.19; 4 1.075,-1.19; 5 1.075,0; 6 1.075,1.19
SOIC245P670X270-4N = smd 1.91 x 0.91: 1 -2.9,1.225; 2 -2.9,-1.225; 3 2.9,-1.225; 4 2.9,1.225
MAX-M10S = smd 1.8 x 0.8: EXTINT 4.8,0; GND$12 -4.8,2.2; LNA_EN -4.8,1.1; RF_IN -4.8,3.3; RXD 4.8,-2.2; SCL -4.8,-3.3; SDA -4.8,-2.2; TIMEPULSE 4.8,-1.1; TXD 4.8,-3.3; V_BCUP 4.8,1.1; V_IO 4.8,2.2; VCC 4.8,3.3; VCC_RF -4.8,0; VIO_SEL -4.8,-1.1 | smd 1.8 x 0.7: GND$1 4.8,-4.35; GND$10 -4.8,4.35; RESET_N 4.8,4.35; SAFEBOOT_N -4.8,-4.35
GNS5XXX = smd 1.75 x 2.4: 1 -11.43,-7.6; 2 -8.89,-7.6; 3 -6.35,-7.6; 4 -3.81,-7.6; 5 -1.27,-7.6; 6 1.27,-7.6; 7 3.81,-7.6; 8 6.35,-7.6; 9 8.89,-7.6; 10 11.43,-7.6; 16 11.43,7.6; 17 -11.43,7.6 | smd 2 x 0.92: 11 12.38,-5.1; 12 12.38,-4; 13 12.38,-2.9; 14 12.38,-1.8 | smd 2.4 x 1.75: 15 13.2,0; 18 -13.2,0
HC125.A = smd 1.625 x 1.75: 1 -3.022,2.475; 2 3.022,2.475; 3 3.022,-2.475; 4 -3.022,-2.475 | drill 0.5: GND$0 0,0; GND$1 0,2.4; GND$2 0,1.2; GND$3 0,-2.4; GND$4 0,-1.2; GND$5 -2.4,0; GND$6 -1.2,0; GND$7 2.4,0; GND$8 1.2,0
GNS3303 = smd 0.95 x 1.55: 1 -4.375,-4.275; 2 -3.125,-4.275; 3 -1.875,-4.275; 4 -0.625,-4.275; 5 0.625,-4.275; 6 1.875,-4.275; 7 3.125,-4.275; 8 4.375,-4.275; 9 4.375,4.275; 10 3.125,4.275; 11 1.875,4.275; 12 0.625,4.275; 13 -0.625,4.275; 14 -1.875,4.275; 15 -3.125,4.275; 16 -4.375,4.275 | smd 2.85 x 2.65: E1 -3.95,-1.25; E2 3.95,-1.25
EMPCB.CSMAFST.A = smd 2 x 4: GND$0 -3,2; GND$1 3,2; RF 0,2 | smd 2 x 4 bottom: GND$2 -3,2; GND$3 3,2
SOIC127P600X150-8N = smd 1.58 x 0.589: D1$1 -2.625,1.905; D1$2 -2.625,0.635; D2$1 -2.625,-0.635; D2$2 -2.625,-1.905; G1 2.625,1.905; G2 2.625,-0.635; S1 2.625,0.635; S2 2.625,-1.905
SOP65P280X100-8N = smd 1.237 x 0.459: GATE 1.187,0.325; GATEP -1.187,-0.325; GND -1.187,-0.975; IN 1.187,-0.975; ON -1.187,0.975; OUT -1.187,0.325; PWRGD 1.187,0.975; SENSE 1.187,-0.325
IND_BOURNS_SRN6045 = smd 2.007 x 5.994: 1 -2.159,0; 2 2.159,0

### Placement (x,y rotation side)
1  4.5,16 90 top
2  4.5,10 90 top
C1  25.1,16.25 0 top
C2  24.6,19.1 0 top
C3  18.55,18.85 270 top
C4  16.6,20.6 270 top
C5  41.35,20.35 0 top
C6  41.35,18.55 0 top
C7  25.1,14.55 0 top
C8  41.55,5.3 180 top
C9  41.55,7.1 180 top
C10  33.85,23.35 90 top
C11  39.95,23.35 90 top
C12  41.75,23.35 270 top
C13  43.2,10 90 top
C14  45,10 90 top
C15  44.6,50.4 0 top
C16  44.6,48.55 0 top
C17  15.15,60.75 180 top
C18  15.15,62.65 180 top
C19  27.9,50.3 0 top
C20  60.6,55.05 270 bottom
C21  60.6,51.5 90 bottom
D1  45.85,13.9 270 top
FIX  6.2,54.45 0 top
FRM  6.2,49.65 0 top
I1  53.15,3.75 0 top
I2  53.15,2.05 0 top
I3  33.2,1.25 180 top
IC1  20.05,15.05 180 top
IC2  36.9,23.4 270 top
J1  56.25,13 90 top
JP1  36.5,4.45 45 top
JP2  36.7,94.65 0 top
JP3  65.7,88.51 180 bottom
JP4  12.3,74.25 90 top
L1  23.99,50.3 180 top
L2  14.65,18.95 90 top
MD1  58.85,68.85 180 bottom
OUTPUT_MODE  54.05,44.7 0 bottom
PWR  6.2,56.75 0 top
R1  45.5,20.35 180 top
R2  14.7,6.7 90 top
R3  16.65,6.7 90 top
R4  14.55,55.5 180 top
R5  27.9,52.14 180 top
R6  41.35,16.4 180 top
R7  28.95,7.25 0 top
R8  48.85,10 90 top
R9  14.55,57.37 0 top
R10  41.55,14.65 0 top
R11  19.2,66.3 270 top
R13  47.55,16.75 180 top
R14  28.95,9.1 0 top
R15  41.4,10 270 top
R16  41.55,3.5 0 top
R17  41.55,1.7 0 top
R18  32.55,9.1 180 top
U1  47.3,4.45 270 top
U2  20.05,10.75 0 top
U3  57.4,86.55 180 bottom
U4  57.4,88.05 0 top
U$1  33.25,15.8 0 top
U$2  47.1,60.35 0 top
U$3  12.35,13 90 top
U$4  22.57,58.45 0 top
U$5  38.2,43.4 0 top
U$6  23.2,43.4 0 top
U$7  51.25,22.45 0 top
U$8  44.85,23.5 0 top
U$9  65.35,53.25 90 bottom

### Tracks (layer width: path | path; a pad name or v marks a point on that pad's centre or on a via)
3V3  (via drill 0.4)  (4 unrouted)
  Top 0.2: 7.15,56.55 9.8,56.55 arc45 11.15,57.11 11.66,57.62 arc-45 13.37,58.33 15.05,58.33 arc90 16,59.28 v16,59.75 28.1,59.75 arc-90 29.15,58.7 29.15,52.56 arc-45 28.98,52.14
  Top 0.3: C17.1 | 7.15,56.55 PWR.2 | 28.98,52.14 R5.1
  Top 0.305: 34.59,4.57 JP1.2 arc45 34.7,4.93 34.8,5.17 34.8,5.23 arc-45 35.66,7.31 36.04,7.69 arc45 36.6,9.04 36.6,19.91 arc-45 36.94,20.74 37.48,21.28 arc45 37.7,21.81 37.7,21.85 IC2.5 37.85,22.15 37.8,22.2 37.8,22.25
  Top 0.6: U$1.VCC 38.15,19 39.3,19 39.75,18.55 C6.1 C5.1 C11.1 37.85,22.5 IC2.5 | C17.1 v16,59.75
  Top 0.8: U$1.VCC U$1.V_IO U$1.V_BCUP | C6.1 R6.2 | 19.45,62.75 U$4.15 U$4.16 18.15,62.65 C18.1 C17.1
  Bottom 0.3: v16,59.75
  other vias: 16,60.75
  pour Bottom (no thermals): 0.6,99.35 15.6,99.35 15.6,66.45 16.6,66.45 16.6,59.4 arc-90 15.45,58.25 0.6,58.25
5V0  (via drill 0.4)  (6 unrouted)
  Top 0.305: 42.4,7.35 C9.1 | 45.5,6.55 45.2,6.55 45.1,6.65 | 45.5,6.55 45.8,6.55 U1.7 45.8,7.25 45.7,7.35 | 45,6.75 44.72,7.03 arc45 44.19,7.25 44.05,7.25 43.95,7.35 | 45,6.75 45.1,6.65 | 45.5,6.55 45.5,7.3 45.45,7.35 | 45.2,7.35 45.2,6.75 45.1,6.65 | 45,7.4 45,6.75
  Top 0.4: R16.1 40.7,3.6 | U$7.D1$1 v50.1,24.36 | U$7.D1$2 50.1,23.09 v50.1,23.1 | IC2.1 38.65,24.8
  Top 0.45: U$7.D1$2 U$7.D1$1 | U$8.OUT 44.85,23.82 v44.85,24
  Top 0.5: 45.7,7.35 45.45,7.35 45.2,7.35 43.95,7.35 42.4,7.35 | IC2.1 37.84,24.9 | C8.1 40.7,3.6 | 38.65,24.8 38.65,25.24 41.33,25.24 arc-90 41.75,24.82 C12.1
  Top 0.8: C8.1 C9.1 | 43.69,52.35 U$2.4 | 43.48,52.48 43.43,52.61 arc-45 U$2.4 | U$2.4 43.74,52.3 C15.1 C16.1
  Route15 0.152: C16.1 43.65,48.65 | C21.1 60.6,50.6
  Bottom 0.4: C8.1 42.4,5.47 arc-45 42.25,5.83 42.25,11.93 arc-45 42.78,13.22 42.97,13.41 arc45 43.51,14.7 43.51,22.93 arc90 42.24,24.2 C12.1
  Bottom 1: C21.1 60.65,50.6 65.35,50.6 U$9.1
  Bottom 1.1: C21.1 v58.85,50.65
  other vias: 42.4,5.3 41.75,24.2 43.75,48.55 60.6,50.65 59.73,50.65
  pour Bottom: 41.75,24.3 41.75,25.4 50.75,25.4 50.75,22.5 arc-90 49.75,21.5 43.55,21.5 43.55,23.3 arc90 42.55,24.3
  pour Top: 34.9,25.5 34.9,23.15 42.8,23.15 42.8,25.5
  pour Route15 (no thermals): 1.6,101.15 51.1,101.15 51.1,55.35 arc90 52.1,54.35 71.4,54.35 71.4,40.25 1.6,40.25
  pour Bottom (no thermals): 60.85,51.2 61.15,51.2 arc90 61.65,51.7 61.65,51.9 arc-90 61.85,52.1 68.25,52.1 arc-90 68.35,52 68.35,50.2 arc-90 68.25,50.1 60.9,50.1 arc-90 60.85,50.15
$11
  Top 0.2: IC1.4 22.98,15.55 arc90 23.35,15.92 23.35,16.08 arc-90 23.77,16.5 24,16.5 C1.1
  Top 0.305: 28.2,16.05 U$1.VCC_RF
  Top 0.4: U$1.VCC_RF 28.25,15.6 27.43,15.6 arc90 27.05,15.21 27.05,14.09 arc-90 26.46,13.5 25.23,13.5 arc-90 24.6,14.13 24.6,14.2 C7.1
  Top 0.8: C1.1 C7.1
CTS  (via drill 0.35, 0.4)
  Top 0.2: JP2.11 24.52,92.63 arc-45 23.48,92.2 23.15,92.2 arc45 21.44,91.49 15.46,85.51 arc45 14.8,83.92 14.8,81.47 arc45 15.39,80.05 JP4.6 17,78.44 arc-45 17.5,77.23 17.5,68.13 arc45 18.23,66.37 19.15,65.45 R11.2
  Top 0.3: 53.45,53.05 U$2.8 53.45,52.45 v53.5,52.5
  Bottom 0.2: v53.5,52.5 52.76,53.19 arc45 51.89,53.55 51.3,53.55 arc-90 49.3,55.55 49.3,65.7 arc90 46.6,68.4 19.4,68.4 arc90 18.3,67.3 18.3,66.91 arc45 18.7,65.95 R11.2
  other vias: 19.2,65.45
D+  (via drill 0.4)
  Top 0.3: U1.4 47.3,10.89 arc45 47.04,11.51 46.68,11.87 arc-45 46.41,12.54 46.84,12.97 v46.98,12.97 | v46.98,12.97 D1.3 | v46.98,12.97 47.27,12.97 47.5,12.75 J1.A6 | J1.B6 50.14,13.75 arc-45 49.56,13.99 49.36,14.19 arc45 48.73,14.45 v48.45,14.45
  Bottom 0.3: v48.45,14.45 v46.98,12.97
D-  (via drill 0.4)
  Top 0.3: U1.5 46.8,10.77 arc45 46.59,11.27 46.25,11.61 arc-45 45.9,12.45 45.9,13.59 arc-45 46.19,14.29 46.75,14.85 D1.4 47.1,14.85 47.5,14.45 arc45 47.68,14.02 47.93,13.77 arc45 48.59,13.5 v48.85,13.5 48.81,13.54 arc45 49.51,13.25 J1.A7 | J1.B7 49.39,12.25 arc45 48.9,12.05 v48.85,12
  Bottom 0.3: v48.85,13.5 v48.85,12
GND  (via drill 0.35, 0.4)  (194 unrouted)
  Top 0.2: R9.2 14.77,56.74 arc45 14.54,56.17 14.54,52.65
  Top 0.254: R9.2 15.29,57.38 | 14.55,52.65 v14.7,52.65 14.54,52.65
  Top 0.3: C14.2 | C14.2 | v43.2,10.86 C13.2 | U1.3 47.8,5.15 v47.85,5.1
  Top 0.305: U1.3 47.8,8.2 47.85,8.25 48.6,8.25
  Top 0.4: 44.35,11.15 45,11.15 C14.2 45,11.95 | v18,4.3 18.05,4.35 | v22.28,49.05 22.38,49.15 | 22.38,51.45 v22.28,51.55
  Top 0.45: IC2.2 v36.9,24.1 | U$1.GND$1 38.2,11.45 38.55,11.1
  Top 0.5: C6.2 42.2,17.45 43.1,17.45 | J1.S3 52.45,7.38
  Top 0.6: J1.B1_A12 50.6,16.2 50.44,16.36 50.59,16.36 50.59,18 46.7,18 R13.2 | 49.75,16.95 49.75,17.1 | C8.2 v40.7,5.29 | 45,11.95 43.95,11.95 | 50.65,9.8 49.95,9.8 49.95,8.6 | 50.65,9.8 J1.A1_B12 50.75,9.8 50.6,9.65 50.6,8.65 50.5,8.65 50.43,8.72 50.43,9.77 50.62,9.77 50.65,9.8
  Top 0.8: 38.55,11.1 v38.55,10.7 | 52.45,7.38 52.45,5.65
  Route2 0.254: C18.2 14.35,62.65 | C17.2 14.25,60.85
  Route15 0.254: C20.2 60.6,54.15 | C21.2 60.6,52.4 | v24.45,55.55 24.41,55.51
  Route15 0.65: 24.41,55.51 arc45 24.12,54.81 v24.12,52.8
  Route15 0.67: v24.12,51.55 v24.12,49.05
  Bottom 0.3: 48.8,8.75 48.85,8.7 | C14.2 | C14.2 | v43.2,10.86 43.14,10.86 43.1,10.9 | C6.2 42.25,18.6 | C12.2 41.8,22.5 | C11.2 39.9,24.25 | C10.2 33.8,24.15
  Bottom 0.6: v40.7,5.29 40.75,5.29 40.75,5.3 | C9.2 40.75,7.1 | 48.8,8.75 48.85,8.8 R8.1 49,9.3 50.6,9.3
  other vias: 12,24.7 12,1.3 12,3.3 12,22.7 10.7,20.8 8.3,20.8 10.7,5.2 8.3,5.2 6.15,14.75 6.15,11.25 6.15,17.25 6.15,8.75 6.3,13 7.2,19.4 7.2,6.6 12.45,6.7 12.2,19.3 47.85,3.9 46.75,3.9 46.75,5.1 40.7,7.1 45,10.85 42.2,20.35 42.2,18.55 41.75,22.5 39.95,24.2 33.85,24.2 48.85,9.15 50.5,9.15 51.05,6.1 40.3,13.6 41.15,12.1 38.75,5.9 39.45,3.5 18,1.3 21,1.3 24,1.3 27,1.3 19.5,2.8 22.5,2.8 25.5,2.8 21,4.3 24,4.3 27,3.3 15,24.7 18,24.7 21,24.7 24,24.7 27,24.7 16.5,23.2 19.5,23.2 25.5,23.2 27,22.7 22.5,5.8 32,24.7 35.55,20.2 34.05,18.7 35.55,17.2 32.55,14.2 34.05,15.7 35.55,14.2 34.05,12.7 31.05,12.7 31.05,15.7 32.55,11.2 35.55,11.2 16.25,9.4 32,22.7 22.4,19.95 23.4,20.2 24.6,20.05 25.8,20.2 7.15,17.25 9,17.4 7.15,14.75 9.3,14.35 7.15,11.25 9.3,11.65 7.15,8.75 8.15,8.85 9.95,17.4 10,8.6 10.9,17.4 11,8.6 52.15,4.9 50.5,8.4 50.5,16.85 50.5,17.6 50.5,19.6 49.25,18.35 48,19.6 16.25,5.55 32.55,17.2 31.05,18.7 32.55,20.2 25.5,5.8 19.5,5.8 21,7.3 16.5,2.8 15,1.3 13.5,2.8 15,4.3 13.5,5.8 13.75,8.6 18,7.3 24,7.3 22.5,8.8 25.5,8.8 25.5,11.8 27,10.3 30,10.3 22.5,23.2 21,21.7 13.5,23.2 16.6,21.45 24,21.7 19.5,8.55 21.5,19.5 20.9,18.7 19.6,17.75 20.6,16.75 22.8,18 23.65,18.05 22.5,16.25 22.5,17.15 24.6,18.15 25.8,18.05 26.9,20.05 26.9,18.15 27.9,20.05 27.9,18.15 28.9,18.15 28.9,20.05 29.85,19.7 29.85,18.55 19.5,16.75 20.6,17.75 19.6,18.75 19.6,19.75 17.5,17.75 17.6,15.75 17.6,16.75 17.6,14.6 17.55,18.8 16.65,18.65 15.65,18.85 15.6,17.4 13.7,17.35 13.6,18.4 13.6,19.85 14.35,20.8 17.65,20.7 15.55,20.7 18.8,20.8 16.25,16.75 16.25,15.75 16.85,13.8 16.35,12.8 16.35,11.7 17.75,9.95 16.8,10.65 22.45,14.6 23.2,13.8 23.75,12.8 23.35,10.65 23.8,11.7 22.4,9.95 18.65,12.85 21.5,12.85 8.15,17.15 8.15,14.85 8.15,11.15 9,8.6 10.3,11.65 10.3,14.35 14.35,14.35 15.35,14.35 15.35,11.65 14.35,11.65 11.5,9.4 13.15,9.4 13.15,16.6 11.55,16.6 15.65,8.6 8.3,13 6.65,8.05 6.65,11.95 6.65,14.05 6.65,17.95 5.65,11.95 5.65,8.05 5.65,14.05 5.65,17.95 10.2,19.3 10.45,6.7 25.95,16.25 25.95,14.55 15,21.7 21,8.55 20.05,13.15 31.45,7.85 34,5.85 28.2,5.1 64.6,57.95 64.6,59.95 60.6,54.2 60.6,52.35 10.2,48.15 5.7,48.15 12.45,45.9 14.7,43.65 14.7,48.15 12.45,50.4 10.2,52.65 7.95,50.4 5.7,52.65 16.95,50.4 19.2,48.15 16.95,45.9 28.2,48.15 30.45,45.9 32.7,48.15 34.95,50.4 32.7,52.65 30.45,54.9 30.45,50.4 32.7,57.15 30.45,59.4 34.95,54.9 37.65,54.75 32.7,61.65 43.95,54.9 39.15,50.7 41.7,48.15 43.95,45.9 48.1,43.65 48.45,45.9 61.95,45.9 64.2,48.15 67.75,47.9 28.2,70.65 32.7,70.65 37.2,70.65 41.7,70.65 46.2,70.65 50.7,70.65 48.45,72.9 50.7,75.15 46.2,75.15 48.45,77.4 46.2,79.65 46.2,84.15 46.2,88.65 23.7,70.65 19.2,70.65 19.2,75.15 19.2,79.65 19.2,84.15 16.95,90.9 41.7,66.15 37.2,66.15 32.7,66.15 28.2,66.15 23.7,66.15 43.95,90.9 39.45,90.9 34.95,90.9 30.45,90.9 25.95,90.9 14.7,88.65 12.45,90.9 7.95,90.9 5.6,92.3 10.2,93.15 10.2,96.75 19.2,60.95 23.7,60.95 27.5,58.15 27.5,55.55 23,58.15 23.15,55.75 18.5,55.55 18.5,58.1 20.7,56.95 25.4,56.95 12.45,54.9 10.2,43.65 29.55,43.65 31.8,43.65 44.6,43.65 60.25,43.65 63.3,43.65 37.27,50.7 39.15,48.2 37.27,48.2 37.27,49.45 39.15,49.45 22.28,52.8 22.28,48.14 24.12,48.14 21.96,50.3 25.87,51.25 37.2,57.15 39.45,59.4 41.7,57.15 37.2,61.65 43.95,63.9 46.2,61.65 13.6,64.2 13.55,68.4 14.3,62.65 14.3,60.75 24.95,46 21.45,46 21.45,44.75 24.95,44.75 21.45,47.25 24.95,47.25 39.95,44.75 39.95,46 39.95,47.25 36.45,44.75 36.45,46 36.45,47.25 16.9,43.65 25.95,46.65 25.95,45.35 20.45,46.65 20.45,45.35 40.95,46.65 40.95,45.35 35.45,46.65 35.45,45.35 57.45,50.8 52.95,50.8 54.05,44.8 65.5,59.45 65.5,58.45 63.7,59.45 63.7,58.45 22.1,55.25 22.08,54.05 36.32,51.85 36.32,53.1 36.67,54.35 40.1,51.85 40.1,53.1 39.75,54.35 38.75,54.75 16.75,83.6 50.4,48.15 45.45,50.4 46.4,43.65 12.45,43.65 19.2,52.65 34.95,59 45.45,48.55 48.45,50.75 41.7,50.4 46.05,65.95 59.7,45.9 59.7,48.15 25.82,52.8
  pour Top: -2.8,28.55 58.9,28.55 arc-90 59.9,27.55 59.9,-2.25 -2.8,-2.25
  pour Bottom: -1.75,27.65 58.85,27.65 58.85,-1.3 -1.75,-1.3
  pour Bottom (no thermals): 4.65,13.7 2.85,13.7 2.85,13.8 4.65,13.8
  pour Top (no thermals): 1.6,40.25 1.6,98.95 50.6,98.95 50.6,86.55 arc90 52.6,84.55 71.4,84.55 71.4,40.25
  pour Bottom (no thermals): 71.4,40.25 1.8,40.25 1.8,57.47 15.2,57.47 arc90 17.45,59.72 17.45,68.55 16.6,68.55 16.6,99.45 48.2,99.45 48.2,79.25 arc90 49.2,78.25 50.5,78.25 arc-90 51.1,77.65 51.1,70.45 48.2,70.45 48.2,56.95 71.4,56.95
  pour Bottom (no thermals): 63.1,57.45 67.1,57.45 arc90 67.9,58.25 67.9,59.55 arc90 67.1,60.35 63.1,60.35 arc90 62.3,59.55 62.3,58.25 arc90
  pour Route2 (no thermals): 1.2,39.35 1.2,100.85 72.3,100.85 72.3,39.35
  pour Bottom: 19.2,43.4 19.55,43.4 21.2,43.4
N$1
  Top 1.1: 1.1 9.85,16 U$3.2
N$2
  Top 1.1: U$3.1 9.85,10 2.1
N$3  (via drill 0.4)
  Top 0.2: v6.6,53.35 6.77,53.18 arc-45 6.95,52.75 FRM.2
  Top 0.3: U$2.5 45.83,52.48 v45.8,52.5 | 6.9,49.65 FRM.2
  Bottom 0.2: v45.8,52.5 47.53,54.18 arc45 47.9,55.08 47.9,64.2 arc90 45.2,66.9 22.68,66.9 arc45 21.26,66.31 17.81,62.86 arc45 17.23,61.45 17.23,59.62 arc-90 15.25,57.65 8.95,57.65 arc45 7.22,56.93 arc45 6.6,55.44 v6.6,53.35
N$4
  Top 0.6: 34.05,22.3 C10.1 35.95,22.5 IC2.4
N$5  (via drill 0.35)
  Top 0.3: I2.2 v53.88,2.07
  Bottom 0.3: v53.88,2.07 53.08,1.27 arc-45 51.1,0.45 36.78,0.45 arc-45 35.45,1 29.68,6.77 arc45 28.52,7.25 R7.1
  other vias: 28.1,7.25
N$6
  Top 0.8: U$3.4 14.68,9.83 14.68,7.58 R2.2 R3.2
N$7
  Top 0.8: U$3.3 14.65,16.2 L2.1
N$8
  Top 0.2: 18.2,13.8 18.55,13.8 IC1.10
  Top 0.8: U2.2 18.6,10.75 arc-90 17.3,12.05 17.3,12.26 arc-45 17.79,13.38 18.2,13.8
  pour Top (no thermals): 18.9,14.2 18.9,13.4 18.3,13.4 18.3,14.2
N$9
  Top 0.127: 21.9,13.8 21.8,13.8 21.8,13.79 21.55,14.04 IC1.1
  Top 0.8: U2.5 21.6,10.75 arc90 22.85,12 22.85,12.25 arc45 22.4,13.3 21.9,13.8
  pour Top (no thermals): 21.2,14.2 21.2,13.4 21.8,13.4 22,13.6 22,14.05 21.85,14.2
N$10
  Top 0.2: 18.55,16.65 18.6,16.6 IC1.6
  Top 0.8: 18.55,16.65 C3.2
  pour Top (no thermals): 18.95,16.8 18.95,15.9 18.15,15.9 18.15,16.8
N$11
  Top 0.2: IC1.5 21.55,16.6
  Top 0.8: 21.55,16.6 21.55,17.5 arc-90 23.15,19.1 C2.1
  pour Top (no thermals): 21.15,16.65 21.15,15.9 21.25,15.9 21.95,15.9 21.95,16.1 21.95,16.65
N$12
  Top 0.8: U$1.RF_IN C2.2
N$13  (via drill 0.35)
  Top 0.3: I1.2 v53.88,3.77
  Bottom 0.3: 53.84,3.82 53.84,3.81 v53.88,3.77 53.86,3.75 arc-45 53.51,2.9 52.36,1.75 arc-45 50.31,0.9 36.91,0.9 arc-45 35.7,1.4 28.17,8.93 arc-45 R14.1
  other vias: 28.1,9.1
N$14
  Top 0.6: R10.1 40.75,14.7 U$1.TIMEPULSE
N$15
  Top 0.6: R10.2 42.3,16.4 R6.1
N$16
  Top 0.3: R18.1 33.1,8.8 33.1,8.31 arc-45 32.84,7.69 arc45 32.55,6.99 32.55,1.35 I3.2
N$17
  Top 0.8: L2.2 16.59,19.76 C4.2 18.5,19.75 C3.1
N$18
  Top 0.2: U$2.12 58.8,56.35 58.61,56.54 arc45 58.11,56.75 45.54,56.75 arc-45 43.77,57.48 39.33,61.92 arc45 37.56,62.65 31.05,62.65 arc90 30.45,62.05 30.45,61.7 arc-90 29.75,61 26.68,61 arc-90 26.07,61.6 26.07,62.38 U$4.10
  Top 0.25: U$4.10 26.02,63.02
N$19
  Top 0.45: U$7.S1 53.15,23.09 arc90 52.6,22.54 52.6,21.09 arc90 53.15,20.55 U$7.S2
N$20
  Top 0.3: R1.1 46.34,20.35 46.14,20.55
  Top 0.45: U$8.SENSE 46.75,23.18 arc-90 47.25,22.68 47.25,22.32 arc90 47.75,21.82 U$7.D2$1
  Top 0.5: U$7.D2$1 U$7.D2$2 46.14,20.55
N$21
  Top 0.3: R13.1 48.6,16.75 48.7,16.65 48.7,15.99 arc45 49.08,15.09 arc45 49.89,14.75 49.9,14.75 J1.B5
N$22
  Top 0.45: U$8.GATE 46.7,23.82 arc90 47.25,24.38 47.25,24.61 arc-90 47.9,25.26 51.23,25.26 arc-45 52.13,24.89 52.29,24.73 arc45 53.19,24.36 U$7.G1 54.61,24.36 arc-90 55.16,23.8 55.16,22.36 arc-90 54.61,21.82 U$7.G2
N$23
  Top 0.3: J1.A5 50.26,11.75 arc45 49.56,11.46 49.25,11.15 49.15,11.15 R8.2
N$24
  Top 0.2: 59.5,57.45 46.44,57.45 arc-45 44.67,58.18 40.23,62.62 arc45 38.46,63.35 30.5,63.35 arc90 29.8,62.65 29.8,62.2 arc-90 29.2,61.6 arc-90 28.6,62.2 28.6,62.65 arc90 27.9,63.35 26.98,63.35 U$4.9
  Top 0.25: U$4.9 26.68,63.02 | 59.5,57.45 U$2.13
  Top 0.3: U$4.9 26.98,63.02 27.3,63.35
N$25
  Top 0.2: 22.23,63.37 arc-90 22.86,64 39.48,64 arc-45 41.13,63.32 45.57,58.88 arc45 47.34,58.15 58.04,58.15 arc45 58.65,58.4 58.8,58.55 U$2.14
  Top 0.25: 22.18,62.52 U$4.13
  Top 0.3: U$4.13 22.23,62.98 22.23,63.37
N$26
  Top 0.2: 27.18,54.77 27.86,54.77 arc90 28.52,55.44 28.52,58.28 arc90 27.66,59.15 17.32,59.15 arc90 16.4,58.23 16.4,56.82 arc-45 16.18,56.28 R4.1
  Top 0.3: R4.1 15.4,55.85 15.68,55.85 | 27.18,54.77 26.98,54.58 U$4.8
N$27  (via drill 0.4)
  Top 0.3: U1.9 44.35,5.45 arc45 v43.75,5.2 | v44.06,8.14 42.31,8.14 arc-90 41.8,8.65 41.8,8.95 41.6,9.15 R15.2
  Bottom 0.3: 43.8,5.25 v43.75,5.2 43.66,5.29 arc-45 43.16,6.5 arc-45 43.69,7.77 v44.06,8.14
N$28
  Top 0.2: FIX.2 7.36,54.86 arc-45 8.55,55.35 10.44,55.35 arc29 11.56,55.64 11.59,55.65 arc-29 12.36,55.85 13.35,55.85
  Top 0.3: R4.2 13.35,55.85
N$29
  Top 0.352: L1.1 C19.1 27.05,52.1 27.07,52.12 R5.2
N$30  (via drill 0.4)
  Top 0.2: U$2.11 59.55,55.25 59.87,54.93 60.6,54.93 arc-90 61.3,54.23 61.3,50.65 arc-90 60.65,50 54.81,50 arc45 54.19,49.74 v53.95,49.5
  Top 0.25: 59.4,55.15 59.4,55.17 U$2.11 60.28,55.25
  Bottom 0.2: 53.15,49.5 53.08,49.43
  Bottom 0.25: OUTPUT_MODE.3 53.08,49.43
  Bottom 0.406: v53.95,49.5 53.15,49.5
N$31
  Top 0.2: 5.65,56.55 arc90 6.25,55.95 10.27,55.95 arc45 11.47,56.45 11.6,56.57 arc-45 12.57,56.98 13.3,56.98
  Top 0.25: PWR.1 5.65,56.55
  Top 0.3: 13.3,56.98 R9.1
N$32  (1 unrouted)
  pour Bottom (no thermals): 59.6,84.65 67.3,84.65 arc90 68.1,85.45 68.1,87.9 arc90 67.7,88.3 66.5,88.3 arc90 66.1,87.9 66.1,86.55 arc-90 65.3,85.75 62.93,85.75 arc-45 62.37,85.98 62.35,86 arc45 61.79,86.23 59.6,86.23 arc90 59.2,85.83 59.2,85.05 arc90
N$33  (1 unrouted)
  pour Bottom (no thermals): 62.14,86.95 59.6,86.95 arc-90 59.2,87.35 59.2,87.9 arc-90 59.6,88.3 64.9,88.3 arc-90 65.3,87.9 65.3,86.85 arc-90 64.9,86.45 63.31,86.45 arc-45 62.74,86.68 62.71,86.72 arc45
N$34  (1 unrouted)
  pour Top (no thermals): 62.15,91.2 65.3,91.2 arc-90 66.1,90.4 66.1,89.15 arc90 66.5,88.75 67.7,88.75 arc90 68.1,89.15 68.1,91.25 arc90 67.3,92.05 60,92.05 arc90 59.2,91.25 59.2,88.75 arc90 59.6,88.35 60.95,88.35 arc90 61.35,88.75 61.35,90.4 arc-90
N$35  (1 unrouted)
  pour Top (no thermals): 65.4,90.25 65.4,89.15 arc-90 65,88.75 63.85,88.75 arc90 63.05,87.95 63.05,86.65 arc-90 62.65,86.25 59.6,86.25 arc-90 59.2,86.65 59.2,87.35 arc-90 59.6,87.75 61.1,87.75 arc90 61.9,88.55 61.9,90.25 arc-90 62.3,90.65 65,90.65 arc-90
N$36  (via drill 0.4)  (5 unrouted)
  other vias: 53.05,86.88 53.05,87.85 54.05,86.88
  pour Top (no thermals): 55.7,87.9 55.7,86.65 arc-90 55.3,86.25 53,86.25 arc-90 52.6,86.65 52.6,87.9 arc-90 53,88.3 55.3,88.3 arc-90
  pour Bottom (no thermals): 58.55,84.55 58.55,87.55 arc90 57.75,88.35 53,88.35 arc90 52.6,87.95 52.6,86.85 arc90 53,86.45 56.3,86.45 arc-90 57.1,85.65 57.1,81.05 arc90 57.9,80.25 66.7,80.25 arc90 67.5,81.05 67.5,82.95 arc90 66.7,83.75 59.35,83.75 arc-90
N$37  (via drill 0.4)  (5 unrouted)
  other vias: 53.05,89.45 53.05,90.35 54.05,90.35
  pour Top (no thermals): 55.3,90.8 53,90.8 arc90 52.6,90.4 52.6,89.2 arc90 53,88.8 55.3,88.8 arc90 55.7,89.2 55.7,90.4 arc90
  pour Bottom (no thermals): 51.2,80.25 55.6,80.25 arc90 56.4,81.05 56.4,85.45 arc90 56,85.85 52.7,85.85 arc-90 51.9,86.65 51.9,88.15 arc-90 52.7,88.95 54.2,88.95 arc90 54.6,89.35 54.6,90.45 arc90 54.2,90.85 51.2,90.85 arc90 50.4,90.05 50.4,81.05 arc90
N$38  (1 unrouted)
  Bottom 1: 65.35,55.9 U$9.2
  Bottom 1.1: C20.1 65.35,55.9
  pour Bottom (no thermals): 60.2,55.35 60.2,56.45 arc-90 59.82,56.83 59.82,59.55 arc90 59.02,60.35 53.9,60.35 arc90 53.1,59.55 53.1,57.65 arc90 53.9,56.85 56.06,56.85 arc-40 57.35,56.38 58.34,55.54 arc40 58.86,55.35
  pour Bottom (no thermals): 61.15,56.45 61.15,55.35 arc-90 61.65,54.85 61.65,54.6 arc90 61.85,54.4 68.25,54.4 arc90 68.35,54.5 68.35,56.35 arc90 68.25,56.45
RF1
  Top 0.352: U$4.5 23.2,50.32 L1.2 23.2,50.28 U$6.RF
RF2
  Top 0.352: U$2.2 U$5.RF
  Top 0.8: U$5.RF
RTS  (via drill 0.35, 0.4)
  Top 0.2: JP4.7 17.61,80.37 arc-45 18.2,78.95 18.2,68.15 arc90 18.85,67.5 R11.1 | 16.1,81.88 arc-45 15.51,83.3 15.51,83.38 arc-45 16.27,85.22 22.16,91.11 arc-45 23.34,91.6 24.9,91.6 arc90 26.5,93.2 arc-90 27.95,94.65 53.65,94.65 arc45 55.07,95.24 JP2.36
  Top 0.3: U$2.7 v50.9,52.5 | JP4.7 16.1,81.88
  Top 0.8: R11.1 19.25,67.2
  Bottom 0.2: 50.75,52.49 arc-90 48.6,54.64 48.6,64.95 arc90 45.9,67.65 20.23,67.65 arc45 19.33,67.28 R11.1
  Bottom 0.3: v50.9,52.5 50.78,52.5 50.75,52.49
  other vias: 19.2,67.15
RX  (via drill 0.4)  (1 unrouted)
  Top 0.2: JP4.3 14.99,72.83 arc-45 14.1,74.98 14.1,84.32 arc-45 14.76,85.91 20.96,92.11 arc45 21.4,93.18 21.4,93.94 arc45 20.86,95.25 JP2.8
  Top 0.3: v51.15,4.9 arc45 51.03,4.95 U1.26 | U$1.RXD 38.25,13.4 38.85,13.4 arc-90 39.95,12.3 39.95,9.87 arc-45 39.19,8.04 38.54,7.39 arc45 37.85,5.72 37.85,5.54 arc45 JP1.3 | U$2.10 58.5,52.72 v58.5,52.5
  Bottom 0.2: 16.11,71.64 17.31,70.44 arc45 18.73,69.85 48,69.85 arc-90 50.7,67.15 50.7,57.45 arc90 52.7,55.45 54.5,55.45 arc-45 56.29,54.71 v58.5,52.5
  Bottom 0.3: v51.15,4.9 arc45 50.81,4.76 48.62,2.57 arc-45 46.76,1.8 41.33,1.8 arc-45 38.75,2.87 arc-45 38.15,4.31 JP1.3 | JP4.3 16.11,71.64
RXLED
  Top 0.2: U1.18 47.3,1.53 arc90 48.02,0.81 49.41,0.81 arc45 50.42,1.23 51.09,1.91 arc-45 52.12,2.33 I2.1
SUSLED  (via drill 0.35, 0.4)
  Top 0.3: U1.11 44.32,4.45 arc45 43.75,4.21 v43.75,4.2 | I3.1 33.88,1.32 arc-45 33.15,3.09 33.15,6.96 arc-45 33.36,7.46 v33.8,7.9
  Bottom 0.3: v33.8,7.9 34.06,8.16 arc-45 34.76,8.45 40.48,8.45 arc-45 41.19,8.15 arc-45 41.55,7.29 41.55,5.42 arc90 42.67,4.3 43.51,4.3 arc-45 v43.75,4.2
TX  (via drill 0.4)  (1 unrouted)
  Top 0.2: JP4.2 14.29,70.99 arc-45 13.4,73.14 13.4,84.72 arc-45 14.06,86.31 18.31,90.56 arc45 18.9,91.98 18.9,96.1 arc-90 19.85,97.05 21.05,97.05 arc-45 21.99,96.66 JP2.10
  Top 0.3: U1.25 49.99,4.45 arc-45 50.69,4.16 v51.05,3.8 | JP1.4 36.7,6.25 38.87,8.42 arc45 39.45,9.83 39.45,11.03 39.45,12.15 arc90 38.9,12.7 38.25,12.7 U$1.TXD | U$2.9 56.12,52.62 v56,52.5
  Bottom 0.2: v56,52.5 54.59,53.91 arc45 53.04,54.55 52,54.55 arc-90 50,56.55 50,66.45 arc90 47.3,69.15 16.13,69.15
  Bottom 0.3: v51.05,3.8 50.97,3.71 arc45 50.28,3.43 49.1,2.25 arc-45 46.93,1.35 40.96,1.35 arc-45 38.46,2.38 37.16,3.68 arc-45 36.5,5.29 JP1.4 | JP4.2 16.13,69.15
TXLED
  Top 0.2: U1.19 47.8,1.62 arc90 48.22,1.2 49.4,1.2 arc45 49.99,1.44 52.23,3.68
  Top 0.3: I1.1 52.33,3.68 52.23,3.68
VBUS  (via drill 0.35, 0.4)
  Top 0.3: J1.A4_B9 51.09,10.59 51.01,10.59 | D1.2 v44.65,12.95
  Top 0.4: 44.65,21.6 R1.2
  Top 0.45: U$8.GATEP 44.55,23.18 arc-90 44.85,22.88 44.85,22.82 arc90 45.15,22.52 U$8.IN
  Top 0.5: R1.2
  Top 0.6: J1.A4_B9 50.15,10.6 v50.05,10.7 | J1.B4_A9 50.15,15.4 v50.05,15.5 | R1.2 v44.65,19.3
  Bottom 0.6: 44.65,12.85 v44.65,12.95
  other vias: 44.65,20.35
  pour Bottom: 51.2,9.95 49.15,9.95 49.15,12.5 44.2,12.5 44.15,12.55 44.15,21 45.41,21 arc-90 45.8,20.61 45.8,17.62 arc90 47.07,16.35 51.2,16.35
  pour Top: 44.15,23.25 46.1,23.25 46.1,20.4 44.15,20.4
VBUS_RED  (via drill 0.4)
  Top 0.3: U1.8 44.5,5.95 arc-90 v44.05,6.4
  Top 0.4: R16.2 v42.4,3.48 v42.4,3.47
  Top 0.8: R16.2 R17.2
  Bottom 0.3: 42.47,3.4 44,3.4 arc90 44.7,4.1 44.7,5.44 arc45 44.48,5.97 v44.05,6.4
  Bottom 0.406: v42.4,3.47 42.47,3.4
VDD  (via drill 0.35, 0.4)
  Top 0.3: U1.6 46.3,7.9 arc90 45.44,8.76 45.55,8.76 | C14.1 45,9.45 45.55,9.45 | 45.55,9.45 45.85,9.15 | 45.85,9.15 46.25,8.75 | 46.25,8.75 arc90 46.3,8.7 46.3,7.85 | 45.55,9.45 45.55,8.76 | 45.55,8.76 45.55,8.75 45.85,8.75 | 45.85,8.75 46.25,8.75 | 45.85,9.15 45.85,8.75
  Top 0.305: 45.44,8.76 45.39,8.76 C14.1
  Top 0.5: C13.1 41.87,10.48 41.44,10.85 R15.1
  Top 0.8: C13.1 C14.1 | R18.2 R14.2 R7.2
  Bottom 0.3: R15.1 40.39,9.84 arc-45 38.58,9.09 R18.2
  other vias: 41.4,10.85 31.7,9.1

### Text on the board
tPlace: 2 | FIX | 1 | 4 | MAX | RX | ver. | 1.5 | SUS | TX
bPlace: YOTSUBA_GNSS-Rcv-MAX | ver.1.5
tNames: RTS | Rev.0.1 | C | T | S | 3V3 | 5V0 | R | X | KiP-AvSEH1 | T | X | RCVR | F | I | X | F | R | M | ADS-B | R | BEAST | V | A | GNSS | ADSB
bNames: JLCJLCJLCJLC | JLCJLCJLCJLC
tDocu: JLC-04161H-7628